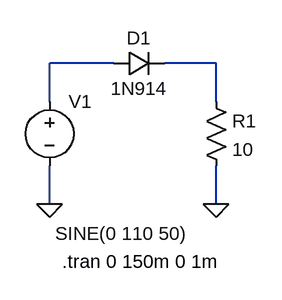
[diagram p0: schematic mediaonda.asc]
mediaonda.asc, the LTspice schematic file:
Version 4
SHEET 1 880 680
WIRE -192 240 -272 240
WIRE -64 240 -128 240
WIRE -272 288 -272 240
WIRE -64 288 -64 240
WIRE -272 416 -272 368
WIRE -64 416 -64 368
FLAG -272 416 0
FLAG -64 416 0
SYMBOL diode -192 256 R270
WINDOW 0 32 32 VTop 2
WINDOW 3 0 32 VBottom 2
SYMATTR InstName D1
SYMATTR Value 1N914
SYMBOL voltage -272 272 R0
WINDOW 123 0 0 Left 2
WINDOW 39 0 0 Left 2
WINDOW 3 7 181 Left 2
SYMATTR Value SINE(0 110 50)
SYMATTR InstName V1
SYMBOL res -80 272 R0
SYMATTR InstName R1
SYMATTR Value 10
TEXT -256 488 Left 2 !.tran 0 150m 0 1m

The netlist it stands for:
* mediaonda.asc
D1 N001 N002 1N914
V1 N001 0 SINE(0 110 50)
R1 N002 0 10
.model D D
.lib standard.dio
.tran 0 150m 0 1m
.backanno
.end